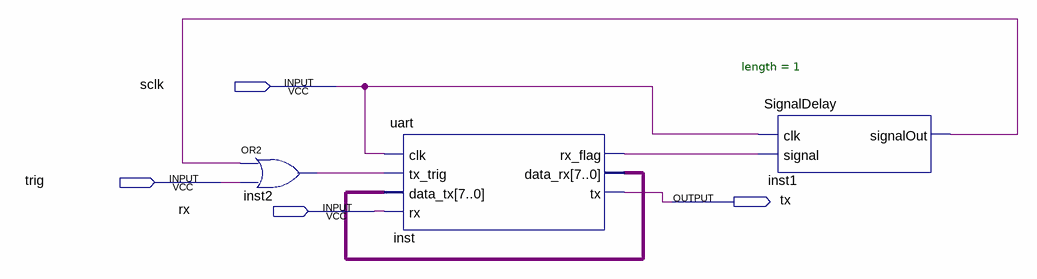
[diagram p0: schematic sheet]
// Quartus schematic uart_test.bdf as structural Verilog: 3 symbols, 4 pins
module uart_test (
  input  sclk,
  input  trig,
  input  rx,
  output tx
);

  wire inst1_signalout, inst2_out, inst_rx_flag;
  wire [7:0] inst_data_rx;

  or inst2 (inst2_out, inst1_signalout, trig);
  uart inst (
    .clk(sclk), .tx_trig(inst2_out), .data_tx(inst_data_rx), .rx(rx), .rx_flag(inst_rx_flag),
    .data_rx(inst_data_rx), .tx(tx));
  SignalDelay #(.length(1)) inst1 (.clk(sclk), .signal(inst_rx_flag), .signalOut(inst1_signalout));
endmodule
